# Altium project PD_receiver.PrjPcb
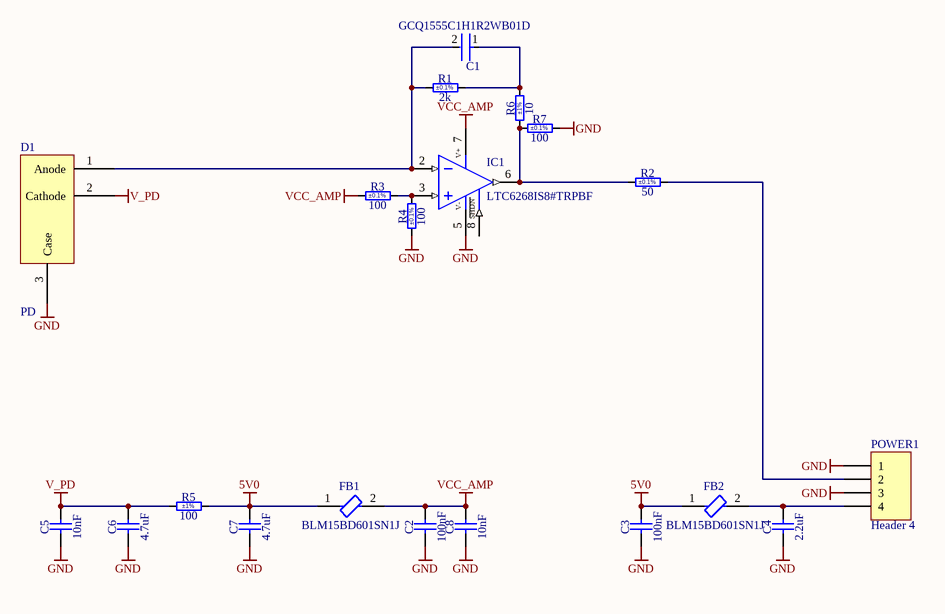
[diagram p0: PD_receiver.SchDoc]
1 sheet, 20 parts. Net scope: global (net labels, ports and power ports of the same name join across sheets).
Board file: PD_receiver.PcbDoc

## Sheet PD_receiver.SchDoc
size A4; SheetNumber: 1; SheetTotal: 1

### Parts
C1  GCQ1555C1H1R2WB01D  [FP-GCQ155-0_05-IPC_B]
C2  100nF  [CAPC1005X55N]
C3  100nF  [CAPC1005X55N]
C4  2.2uF  [CAPC1608X90N]
C5  10nF  [CAPC1005X55N]
C6  4.7uF  [CAPC1709X95N]
C7  4.7uF  [CAPC1709X95N]
C8  10nF  [CAPC1005X55N]
D1  PD  [PD_FTP_BM1]
FB1  BLM15BD601SN1J  [FP-BLM15-0_05-IPC_B]
FB2  BLM15BD601SN1J  [FP-BLM15-0_05-IPC_B]
IC1  LTC6268IS8#TRPBF  [SOIC127P600X175-8N]
POWER1  Header 4  [HDR1X4]
R1  2k  Tolerance: ±0.1%  [RESC1608X55N]
R2  50  Tolerance: ±0.1%  [RESC1005X35N]
R3  100  Tolerance: ±0.1%  [RESC1005X35N]
R4  100  Tolerance: ±0.1%  [RESC1005X35N]
R5  100  Tolerance: ±1%  [RESC1005X40N]
R6  10  Tolerance: ±1%  [RESC1005X40N]
R7  100  Tolerance: ±0.1%  [RESC1005X35N]

### Nets
5V0: C3.2 C7.2 FB1.1 FB2.1 R5.2
GND: C2.1 C3.1 C4.1 C5.1 C6.1 C7.1 C8.1 D1.3(Case) IC1.5(V-) POWER1.1 POWER1.3 R4.1 R7.2
V_PD: C5.2 C6.2 D1.2(Cathode) R5.1
VCC_AMP: C2.2 C8.2 FB1.2 IC1.7(VCC) R3.1
NetC1_1: C1.1 R1.2 R6.2
NetC1_2: C1.2 D1.1(Anode) IC1.2(IN-) R1.1
NetC4_2: C4.2 FB2.2 POWER1.4
NetIC1_3: IC1.3(IN+) R3.2 R4.2
NetIC1_6: IC1.6(OUT) R2.1 R6.1 R7.1
NetPOWER1_2: POWER1.2 R2.2

Not connected (* = marked no-connect by the designer): IC1 8(~{SHDN})

### Notes on the sheet
- (in symbol LTC6268IS8#TRPBF) V+; SHDN

### Library data of the parts
C1 = CMP-06035-042014-1: High Q Ceramic Capacitor for Automotive 1.2pF ±0.05pF 50VDC C0G 0402 Paper T/R
C2 C3 = CC0402_100NF_16V_10%_X5R: Non-polarised capacitor; Part Description: SMD Multilayer Chip Ceramic Capacitor; Manufacturer: GENERIC; Manufacturer1 Part Number: GRM155R61C104KA88D; Voltage: 16V; TC: X5R; Tolerance: ±10%; Part Number: CC0402_100NF_16V_10%_X5R; Component Kind: Standard; Component Type: Standard; Pin Count: 2; Value: 100nF; Status: None; Manufacturer Part Number: CC0402_100NF_16V_10%_X5R; Case: 0402; Mounted: Yes; Socket: No; SMD: Yes; Sense: No; Manufacturer1 Example: MURATA; Manufacturer1 ComponentHeight: 0.55mm; HelpURL: \\cern.ch\dfs\Applications\Altium\Datasheets\CC0402_X5R_MURATA_GRM.pdf; Author: CERN DEM JLC; CreateDate: 10.12.2013; LatestRevisionDate: 10.12.2013
C4 = CC0603_2.2UF_10V_20%_X7R: Non-polarised capacitor; Part Description: SMD Multilayer Chip Ceramic Capacitor; Manufacturer: GENERIC; Manufacturer1 Part Number: LMK107B7225MA-T; Voltage: 10V; TC: X7R; Tolerance: ±20%; Part Number: CC0603_2.2UF_10V_20%_X7R; Component Kind: Standard; Component Type: Standard; Pin Count: 2; Value: 2.2uF; Status: Not Recommended; Manufacturer Part Number: CC0603_2.2UF_10V_20%_X7R; Case: 0603; Mounted: Yes; Socket: No; SMD: Yes; Sense: No; Manufacturer1 Example: TAIYO YUDEN; Manufacturer1 ComponentHeight: 0.9mm; HelpURL: \\cern.ch\dfs\Applications\Altium\Datasheets\CC0603_X7R_TAIYO-YUDEN_HIGH-VALUE.pdf; Author: CERN DEM JLC; CreateDate: 22.06.2011; LatestRevisionDate: 27.06.2011
C5 C8 = CC0402_10NF_16V_10%_X7R: Non-polarised capacitor; Part Description: SMD Multilayer Chip Ceramic Capacitor; Manufacturer: GENERIC; Manufacturer1 Part Number: 223878715636; Voltage: 16V; TC: X7R; Tolerance: ±10%; Part Number: CC0402_10NF_16V_10%_X7R; Component Kind: Standard; Component Type: Standard; Pin Count: 2; Value: 10nF; Status: Not Recommended; Manufacturer Part Number: CC0402_10NF_16V_10%_X7R; Case: 0402; Mounted: Yes; Socket: No; SMD: Yes; Sense: No; Manufacturer1 Example: PHYCOMP; Manufacturer1 ComponentHeight: 0.55mm; HelpURL: \\cern.ch\dfs\Applications\Altium\Datasheets\CC0402_X7R_PHYCOMP.pdf; Author: CERN DEM JLC; CreateDate: 03.12.2007; LatestRevisionDate: 03.12.2007
C6 C7 = CC0603_4.7UF_16V_10%_X5R: Non-polarised capacitor; Part Description: SMD Multilayer Chip Ceramic Capacitor; Manufacturer: GENERIC; Manufacturer1 Part Number: EMK107ABJ475KA-T; Voltage: 16V; TC: X5R; Tolerance: ±10%; Part Number: CC0603_4.7UF_16V_10%_X5R; Component Kind: Standard; Component Type: Standard; Pin Count: 2; Value: 4.7uF; Status: None; Manufacturer Part Number: CC0603_4.7UF_16V_10%_X5R; Case: 0603; Mounted: Yes; Socket: No; SMD: Yes; Sense: No; Manufacturer1 Example: TAIYO YUDEN; Manufacturer1 ComponentHeight: 0.95mm; HelpURL: \\cern.ch\dfs\Applications\Altium\Datasheets\CC0603_X7R_TAIYO-YUDEN_HIGH-VALUE.pdf; Author: CERN DEM JLC; CreateDate: 16.12.2013; LatestRevisionDate: 16.09.2014
D1 = PD: Photodiode
FB1 FB2 = CMP-0686-00193-4: Chip Ferrite Bead, 0402, 600Ω @ 100MHz, 0.65Ω, 25%, 200mA; Number of Circuits: 1; Impedance: 600R; DC Resistance (DCR): 650mR; Height: 0.5mm; Width: 0.5mm; Max Operating Temperature: 125°C; Package Quantity: 50000; Case/Package: 0402; Tolerance: 25%; Test Frequency: 100MHz; RoHS Compliant: Yes; Min Operating Temperature: -55°C; Series: BLM; Packaging: Tape and Reel; Termination: SMD/SMT; Length: 1mm; Current Rating: 200mA; Number of Pins: 2; Max DC Current: 200mA
IC1 = LTC6268IS8#TRPBF: 500MHz Ultra-Low Bias Current FET Input Operational Amplifier; Manufacturer: LINEAR TECHNOLOGY; PressFit: No; Bonding: No; Part Number: LTC6268IS8#TRPBF; Component Kind: Standard; Component Type: Standard; Device: LTC6268IS8#TRPBF; PackageDescription: SOIC 8, Pitch 1.27mm - Body 4x5mm, IPC Medium Density; Part Description: 500MHz Ultra-Low Bias Current FET Input Operational Amplifier; Manufacturer Part Number: LTC6268IS8#TRPBF; Pin Count: 8; Case: SOIC8; Mounted: Yes; Socket: No; SMD: Yes; Sense: No; ComponentHeight: 1.75mm; Author: CERN DEM JLC; HelpURL: \\cern.ch\dfs\Applications\Altium\Datasheets\LTC6268IS8#TRPBF.pdf; CreateDate: 02.12.2014; LatestRevisionDate: 02.12.2014
POWER1 = Header 4: Header, 4-Pin; LatestRevisionDate: 17-Jul-2002; LatestRevisionNote: Re-released for DXP Platform.; Publisher: Altium Limited
R1 = R0603_2K_0.1%_0.063W_10PPM: Resistor - 0.1%; Part Description: Thin Film Chip Resistor; Manufacturer: GENERIC; Manufacturer1 Part Number: RN73C1J2K0BTDF; Power: 0.063W; TC: ±10ppm; PressFit: No; Part Number: R0603_2K_0.1%_0.063W_10PPM; Component Kind: Standard; Component Type: Standard; Pin Count: 2; Value: 2k; Status: Not Recommended; Manufacturer Part Number: R0603_2K_0.1%_0.063W_10PPM; Case: 0603; Mounted: Yes; Sense: No; Socket: No; SMD: Yes; Manufacturer1 Example: TYCO HOLSWORTHY; Manufacturer1 ComponentHeight: 0.5mm; HelpURL: \\cern.ch\dfs\Applications\Altium\Datasheets\R0603_Tyco_RN73.pdf; Author: CERN DEM JLC; CreateDate: 03.12.2007; LatestRevisionDate: 13.03.2008
R2 = R0402_50R_0.1%_0.05W_25PPM: Resistor - 0.1%; Part Description: Thin Film Precision Resistor; Manufacturer: GENERIC; Manufacturer1 Part Number: FC0402E50R0BTBS; Power: 0.05W; TC: ±25ppm/°C; PressFit: No; Part Number: R0402_50R_0.1%_0.05W_25PPM; Component Kind: Standard; Component Type: Standard; Pin Count: 2; Value: 50; Status: Not Recommended; Manufacturer Part Number: R0402_50R_0.1%_0.05W_25PPM; Case: 0402; Mounted: Yes; Sense: No; Socket: No; SMD: Yes; Manufacturer1 Example: VISHAY DALE; Manufacturer1 ComponentHeight: 0.38mm; HelpURL: \\cern.ch\dfs\Applications\Altium\Datasheets\R0402_VISHAY_FC.pdf; Author: CERN DEM JMW; CreateDate: 11.08.2016; LatestRevisionDate: 11.08.2016
R3 R4 R7 = R0402_100R_0.1%_0.063W_25PPM: Resistor - 0.1%; Part Description: Thin Film Precision Resistor; Manufacturer: GENERIC; Manufacturer1 Part Number: CPF0402B100RE1; Power: 0.063W; TC: ±25ppm/°C; PressFit: No; Part Number: R0402_100R_0.1%_0.063W_25PPM; Component Kind: Standard; Component Type: Standard; Pin Count: 2; Value: 100; Status: Not Recommended; Manufacturer Part Number: R0402_100R_0.1%_0.063W_25PPM; Case: 0402; Mounted: Yes; Sense: No; Socket: No; SMD: Yes; Manufacturer1 Example: TE CONNECTIVITY; Manufacturer1 ComponentHeight: 0.35mm; HelpURL: \\cern.ch\dfs\Applications\Altium\Datasheets\R0402_TYCO_CPF.pdf; Author: CERN DEM JMW; CreateDate: 22.09.2015; LatestRevisionDate: 22.09.2015
R5 = R0402_100R_1%_0.0625W_100PPM: Resistor - 1%; Part Description: General Purpose Thick Film Chip Resistor; Manufacturer: GENERIC; Manufacturer1 Part Number: 232270671001L; TC: ±100ppm/°C; PressFit: No; Part Number: R0402_100R_1%_0.0625W_100PPM; Component Kind: Standard; Component Type: Standard; Pin Count: 2; Value: 100; Status: Not Recommended; Power: 0.0625W; Manufacturer Part Number: R0402_100R_1%_0.0625W_100PPM; Case: 0402; Mounted: Yes; Sense: No; Socket: No; SMD: Yes; Manufacturer1 Example: YAGEO PHYCOMP; Manufacturer1 ComponentHeight: 0.4mm; HelpURL: \\cern.ch\dfs\Applications\Altium\Datasheets\R0402_Phycomp_RC0402.pdf; Author: CERN DEM JLC; CreateDate: 03.12.2007; LatestRevisionDate: 17.10.2012
R6 = R0402_10R_1%_0.0625W_200PPM: Resistor - 1%; Part Description: General Purpose Thick Film Chip Resistor; Manufacturer: GENERIC; Manufacturer1 Part Number: 232270671009L; TC: ±200ppm/°C; PressFit: No; Part Number: R0402_10R_1%_0.0625W_200PPM; Component Kind: Standard; Component Type: Standard; Pin Count: 2; Value: 10; Status: Not Recommended; Power: 0.0625W; Manufacturer Part Number: R0402_10R_1%_0.0625W_200PPM; Case: 0402; Mounted: Yes; Sense: No; Socket: No; SMD: Yes; Manufacturer1 Example: YAGEO PHYCOMP; Manufacturer1 ComponentHeight: 0.4mm; HelpURL: \\cern.ch\dfs\Applications\Altium\Datasheets\R0402_Phycomp_RC0402.pdf; Author: CERN DEM JLC; CreateDate: 24.06.2009; LatestRevisionDate: 17.10.2012